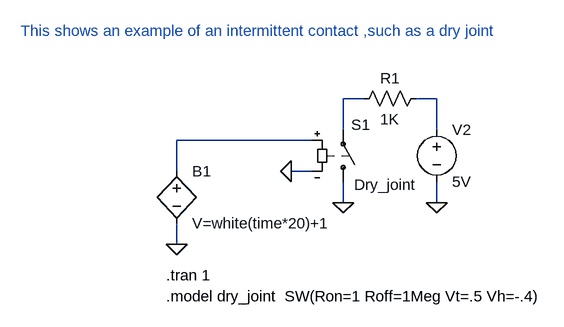
[diagram p0: schematic dry_joint.asc]
dry_joint.asc, the LTspice schematic file:
Version 4
SHEET 1 1276 680
WIRE 224 144 192 144
WIRE 336 144 304 144
WIRE 192 192 192 144
WIRE 336 192 336 144
WIRE 144 208 -64 208
WIRE -64 256 -64 208
WIRE 144 256 112 256
WIRE 192 304 192 272
WIRE 336 304 336 272
WIRE -64 368 -64 336
FLAG 336 304 0
FLAG 192 304 0
FLAG 112 256 0
FLAG -64 368 0
SYMBOL sw 192 288 M180
WINDOW 0 12 104 Left 0
WINDOW 3 17 11 Left 0
SYMATTR InstName S1
SYMATTR Value Dry_joint
SYMBOL voltage 336 176 R0
SYMATTR InstName V2
SYMATTR Value 5V
SYMBOL res 320 128 R90
WINDOW 0 0 56 VBottom 0
WINDOW 3 32 56 VTop 0
SYMATTR InstName R1
SYMATTR Value 1K
SYMBOL bv -64 240 R0
SYMATTR InstName B1
SYMATTR Value V=white(time*20)+1
TEXT -80 448 Left 0 !.model dry_joint  SW(Ron=1 Roff=1Meg Vt=.5 Vh=-.4)
TEXT -80 416 Left 0 !.tran 1
TEXT -304 40 Left 0 ;This shows an example of an intermittent contact ,such as a dry joint

The netlist it stands for:
* dry_joint.asc
S1 0 N001 N003 0 Dry_joint
V2 N002 0 5V
R1 N002 N001 1K
B1 N003 0 V=white(time*20)+1
.model dry_joint  SW(Ron=1 Roff=1Meg Vt=.5 Vh=-.4)
.tran 1
* This shows an example of an intermittent contact ,such as a dry joint
.backanno
.end